# Altium schematic sheet CPU.SchDoc
size A4
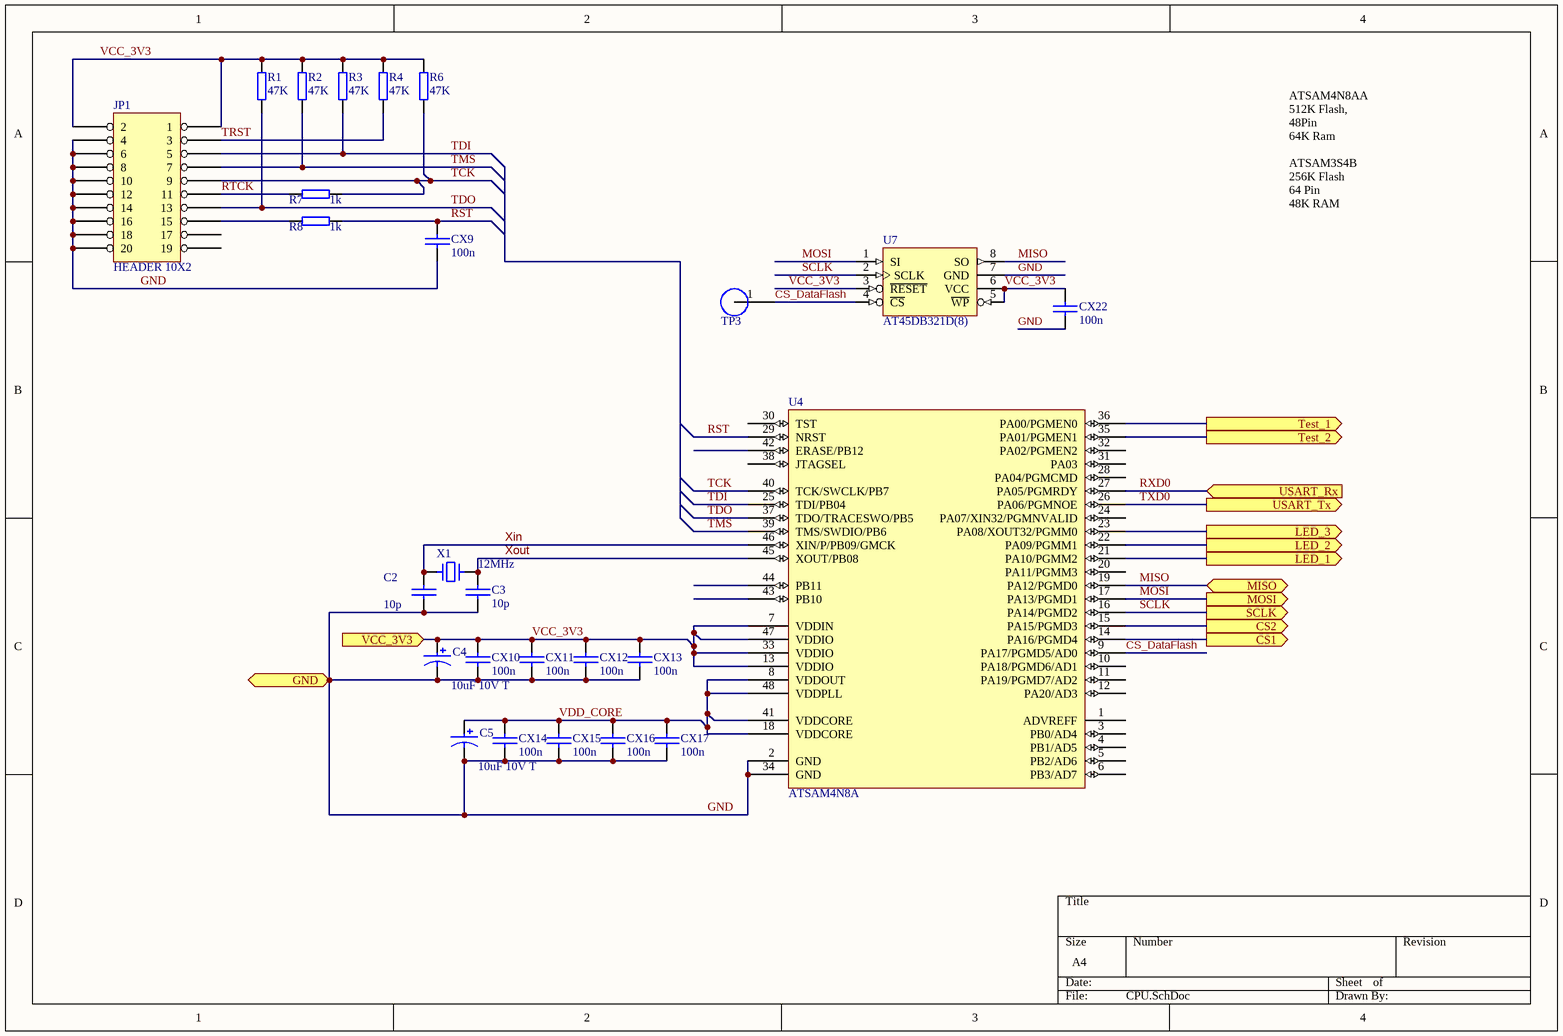
[diagram p0: CPU.SchDoc]

## Parts
C2  10p  [0603]
C3  10p  [0603]
C4  10uF 10V T  [SMD-TANT-A]
C5  10uF 10V T  [SMD-TANT-A]
CX9  100n  [0603]
CX10  100n  [0603]
CX11  100n  [0603]
CX12  100n  [0603]
CX13  100n  [0603]
CX14  100n  [0603]
CX15  100n  [0603]
CX16  100n  [0603]
CX17  100n  [0603]
CX22  100n  [0603]
JP1  HEADER 10X2  [IDC20BOX]
R1  47K  [0603]
R2  47K  [0603]
R3  47K  [0603]
R4  47K  [0603]
R6  47K  [0603]
R7  1k  [0603]
R8  1k  [0603]
TP3  TestPad  [TestPad]  (value not drawn)
U4  ATSAM4N8A  [48A_M]
U7  AT45DB321D(8)  [SO-8W-MLF]
X1  12MHz  [XTAL-V2]

## Ports
CS1 (out), CS2 (out), GND (bidir), LED_1 (out), LED_2 (out), LED_3 (out), MISO (bidir), MOSI (out), SCLK (out), Test_1 (out), Test_2 (out), USART_Rx (in), USART_Tx (out), VCC_3V3 (in)

## Nets
CS1: U4.14(PA16/PGMD4) ; port CS1
CS2: U4.15(PA15/PGMD3) ; port CS2
CS_DataFlash: TP3.1 U4.9(PA17/PGMD5/AD0) U7.4(~{CS})
GND: C2.2 C3.2 C4.2 C5.2 CX9.1 CX10.1 CX11.1 CX12.1 CX13.1 CX14.1 CX15.1 CX16.1 CX17.1 CX22.1 JP1.4 JP1.6 JP1.8 JP1.10 JP1.12 JP1.14 JP1.16 JP1.18 JP1.20 U4.2(GND) U4.34(GND) U7.7(GND) ; port GND
LED_1: U4.21(PA10/PGMM2) ; port LED_1
LED_2: U4.22(PA09/PGMM1) ; port LED_2
LED_3: U4.23(PA08/XOUT32/PGMM0) ; port LED_3
MISO: U4.19(PA12/PGMD0) U7.8(SO) ; port MISO
MOSI: U4.17(PA13/PGMD1) U7.1(SI) ; port MOSI
RST: CX9.2 R8.2 U4.29(NRST)
RTCK: JP1.11 R7.1
RXD0: U4.27(PA05/PGMRDY) ; port USART_Rx
SCLK: U4.16(PA14/PGMD2) U7.2(SCLK) ; port SCLK
TCK: JP1.9 R6.1 R7.2 U4.40(TCK/SWCLK/PB7)
TDI: JP1.5 R3.1 U4.25(TDI/PB04)
TDO: JP1.13 R1.1 U4.37(TDO/TRACESWO/PB5)
Test_1: U4.36(PA00/PGMEN0) ; port Test_1
Test_2: U4.35(PA01/PGMEN1) ; port Test_2
TMS: JP1.7 R2.1 U4.39(TMS/SWDIO/PB6)
TRST: JP1.3 R4.1
TXD0: U4.26(PA06/PGMNOE) ; port USART_Tx
VCC_3V3: C4.1 CX10.2 CX11.2 CX12.2 CX13.2 CX22.2 JP1.1 JP1.2 R1.2 R2.2 R3.2 R4.2 R6.2 U4.7(VDDIN) U4.13(VDDIO) U4.33(VDDIO) U4.47(VDDIO) U7.3(~{RESET}) U7.5(~{WP}) U7.6(VCC) ; port VCC_3V3
VDD_CORE: C5.1 CX14.2 CX15.2 CX16.2 CX17.2 U4.8(VDDOUT) U4.18(VDDCORE) U4.41(VDDCORE) U4.48(VDDPLL)
Xin: C2.1 U4.46(XIN/P/PB09/GMCK) X1.2
Xout: C3.1 U4.45(XOUT/PB08) X1.1
NetJP1_15: JP1.15 R8.1

Not connected (* = marked no-connect by the designer): JP1 17 19; U4 1(ADVREFF) 3(PB0/AD4) 4(PB1/AD5) 5(PB2/AD6) 6(PB3/AD7) 10(PA18/PGMD6/AD1) 11(PA19/PGMD7/AD2) 12(PA20/AD3) 20(PA11/PGMM3) 24(PA07/XIN32/PGMNVALID) 28(PA04/PGMCMD) 30(TST) 31(PA03) 32(PA02/PGMEN2) 38(JTAGSEL) 42(ERASE/PB12) 43(PB10) 44(PB11)

## Notes on the sheet
- ATSAM4N8AA
  512K Flash,
  48Pin
  64K Ram
  ATSAM3S4B
  256K Flash
  64 Pin
  48K RAM

## Library data of the parts
C2 C3 = cap
C4 C5 = CAPACITOR POL-S
CX9-CX17 CX22 = CAP
R1-R4 R6-R8 = RES8
TP3 = TestPad: Test Pad; Supplier1: N/A; PartNo1: N/A; PartNo2: N/A; Supplier2: N/A
U4 = ATSAM4N8A: Cortex-M4, 100MHz, 512K Flash, 64K SRAM; PartNo1: ATSAM4N8AA-AURCT-ND; PartNo2: 2355223; Supplier2: Element14; Supplier1: Digi-Key
U7 = AT45DB041(8)
X1 = CRYSTAL